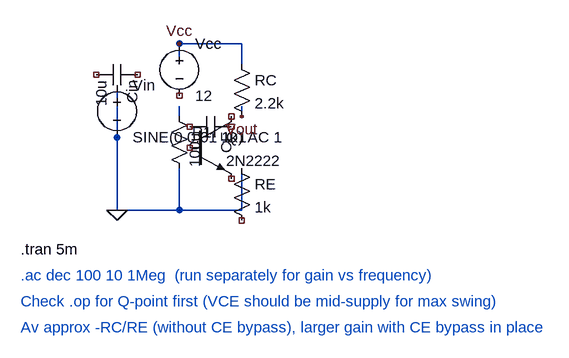
[diagram p0: schematic 10_BJT_common_emitter_amp.asc]
10_BJT_common_emitter_amp.asc, the LTspice schematic file:
Version 4
SHEET 1 880 680
WIRE 400 96 400 64
WIRE 400 64 304 64
WIRE 304 64 304 96
WIRE 400 176 400 160
WIRE 304 176 304 160
WIRE 304 320 304 256
WIRE 400 320 400 256
WIRE 400 320 304 320
WIRE 208 176 208 128
WIRE 208 320 208 176
WIRE 208 320 304 320
FLAG 208 320 0
FLAG 304 64 Vcc
FLAG 400 176 Vout
SYMBOL voltage 304 48 R0
SYMATTR InstName Vcc
SYMATTR Value 12
SYMBOL res 384 80 R0
SYMATTR InstName RC
SYMATTR Value 2.2k
SYMBOL res 288 160 R0
WINDOW 3 -60 40 Invisible 2
SYMATTR InstName R1
SYMATTR Value 22k
SYMBOL res 384 240 R0
SYMATTR InstName RE
SYMATTR Value 1k
SYMBOL cap 384 176 R90
SYMATTR InstName CE
SYMATTR Value 100u
SYMBOL npn 320 176 R0
SYMATTR InstName Q1
SYMATTR Value 2N2222
SYMBOL voltage 208 112 R0
SYMATTR InstName Vin
SYMATTR Value SINE(0 0.01 1k) AC 1
SYMBOL cap 240 96 R90
SYMATTR InstName Cin
SYMATTR Value 10u
TEXT 60 380 Left 2 !.tran 5m
TEXT 60 420 Left 2 ;.ac dec 100 10 1Meg  (run separately for gain vs frequency)
TEXT 60 460 Left 2 ;Check .op for Q-point first (VCE should be mid-supply for max swing)
TEXT 60 500 Left 2 ;Av approx -RC/RE (without CE bypass), larger gain with CE bypass in place

The netlist it stands for:
* 10_BJT_common_emitter_amp.asc
Vcc Vcc NC_01 12
RC Vcc Vout 2.2k
R1 N001 0 22k
RE 0 NC_02 1k
CE NC_03 NC_04 100u
Q1 NC_05 NC_06 NC_07 0 2N2222
Vin 0 0 SINE(0 0.01 1k) AC 1
Cin NC_08 NC_09 10u
.model NPN NPN
.model PNP PNP
.lib standard.bjt
.tran 5m
* .ac dec 100 10 1Meg  (run separately for gain vs frequency)
* Check .op for Q-point first (VCE should be mid-supply for max swing)
* Av approx -RC/RE (without CE bypass), larger gain with CE bypass in place
.backanno
.end